# Altium schematic sheet CONNECTOR_B.SchDoc: =project_title
size Tabloid; CompanyName: Luxonis Holding; Organization: Luxonis Holding; Address1: 1925 Harmony Park Drive; Address2: Westminster, CO; Address3: 80234; Address4: United States; SheetNumber: 6; SheetTotal: 12
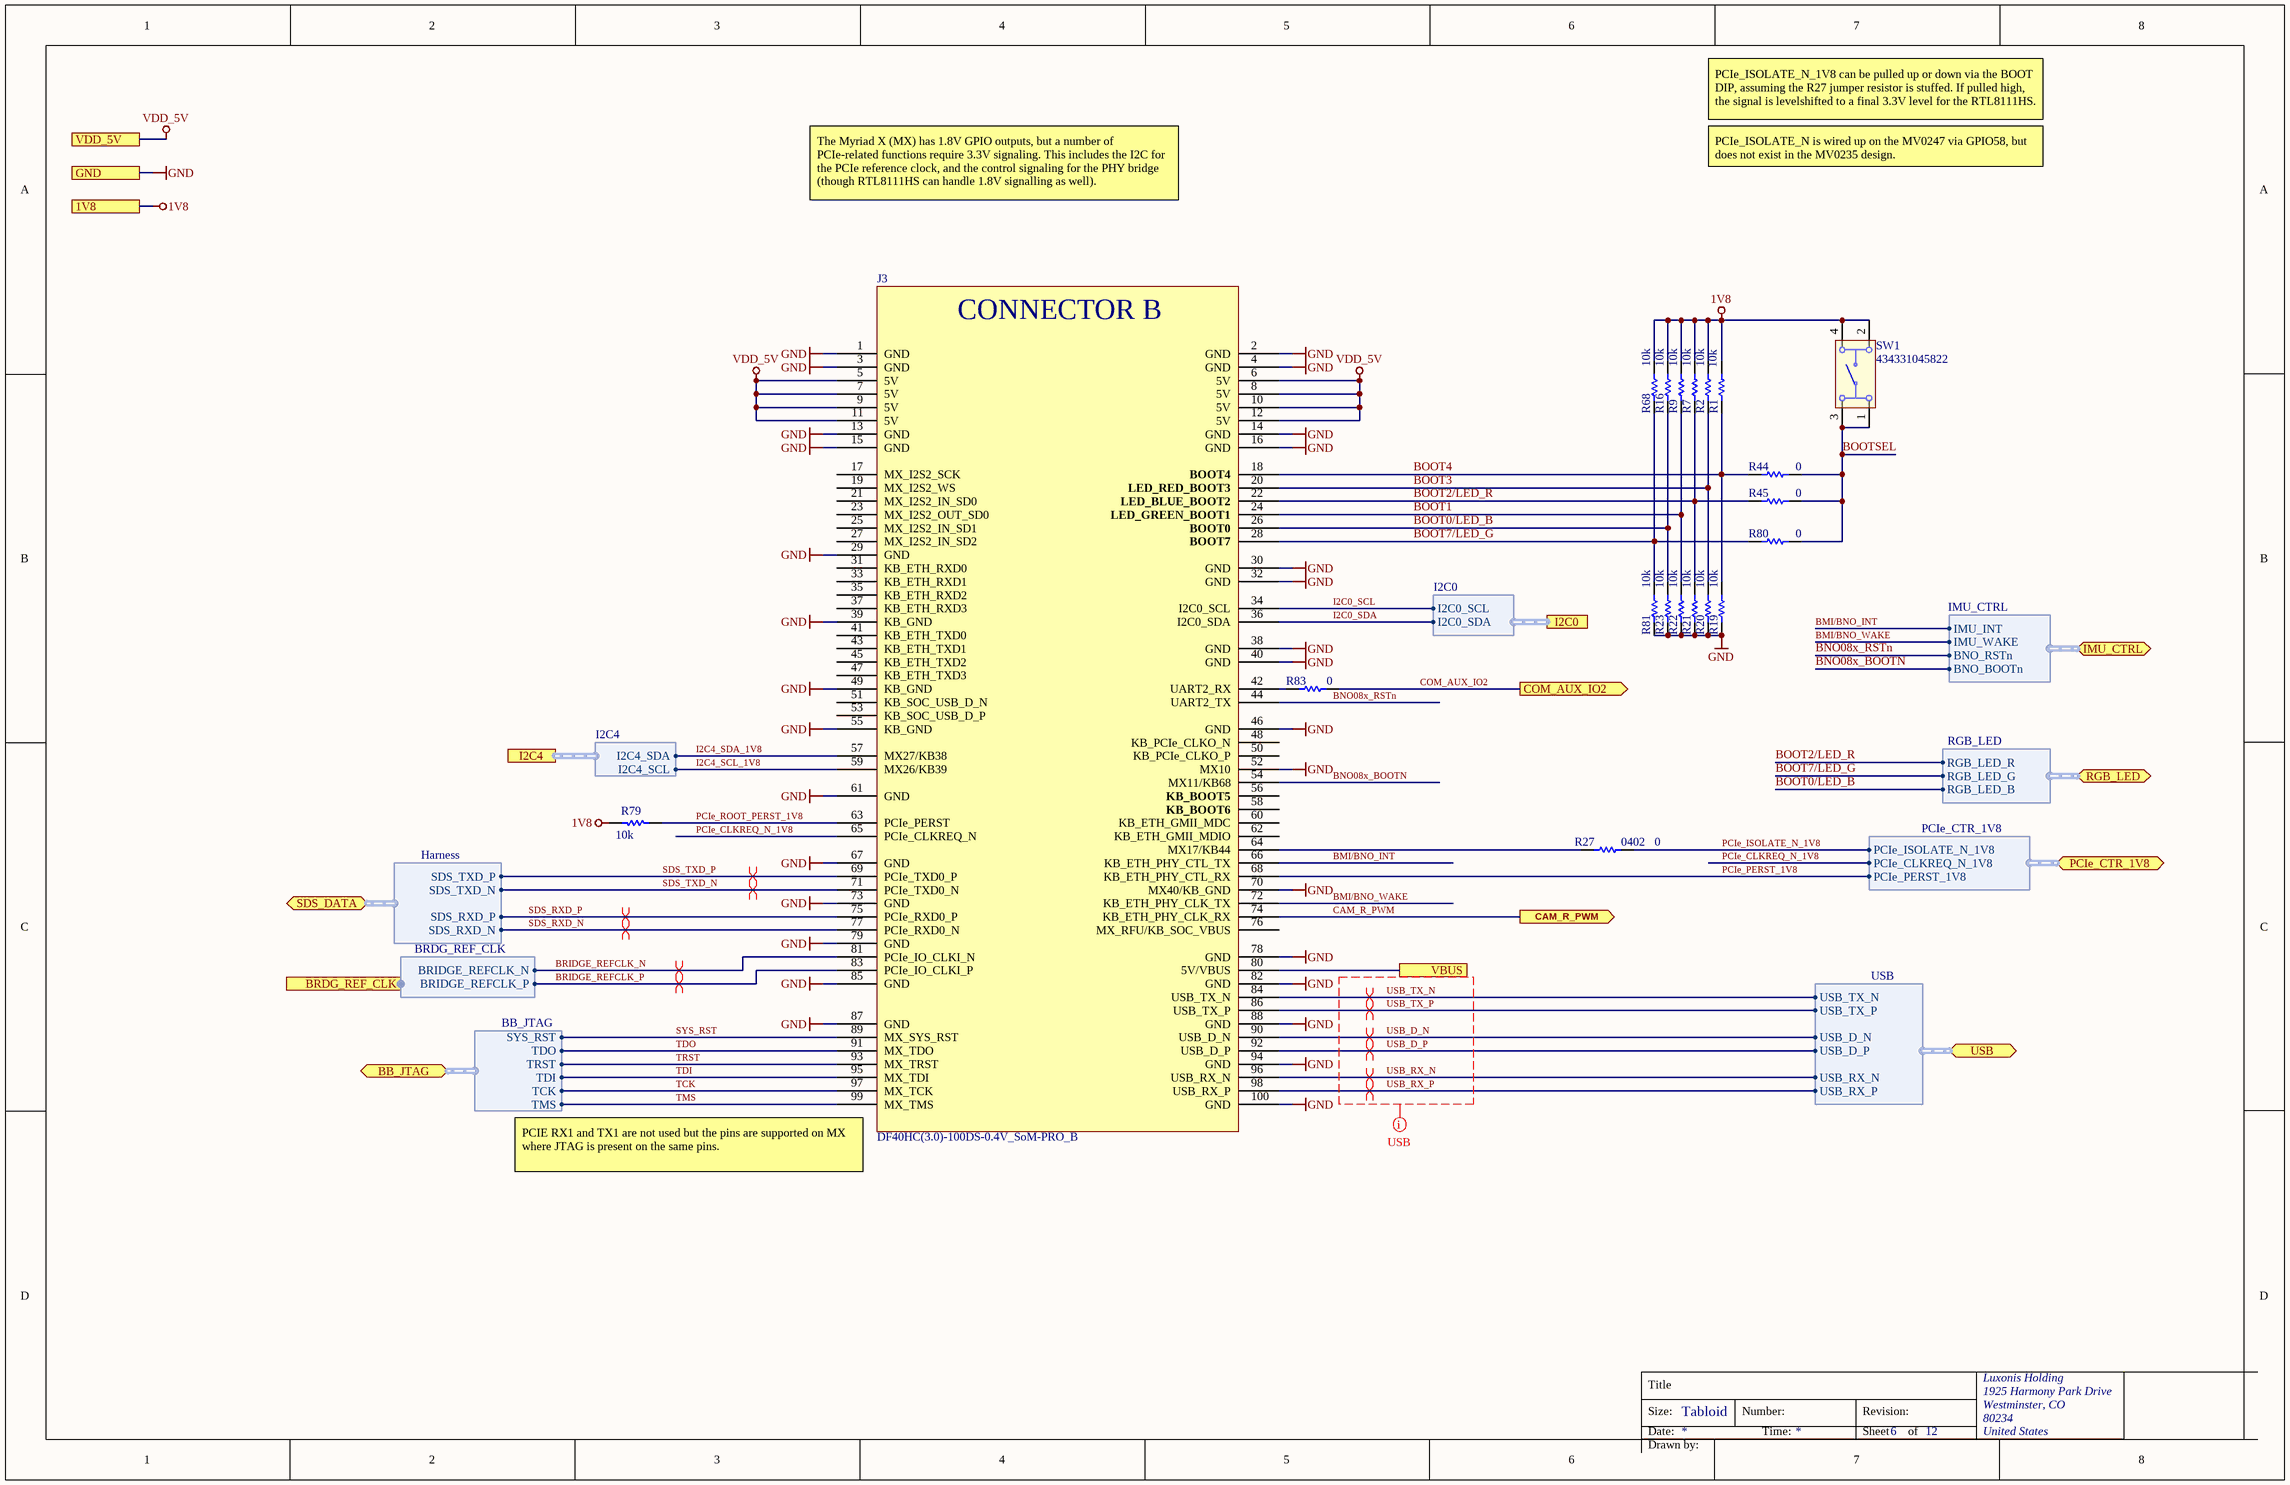
[diagram p0: CONNECTOR_B.SchDoc]

## Parts
J3  DF40HC(3.0)-100DS-0.4V_SoM-PRO_B  [CON_B_BW2099_SoM_DF40HC-3.0-100DS-0.4V_minpad]
R1  value 10k  [RESC0402(1005)_L]  (hidden comment: RC0402FR-1310KL)
R2  value 10k  [RESC0402(1005)_L]  (hidden comment: RC0402FR-1310KL)
R7  value 10k  [RESC0402(1005)_L]  (hidden comment: RC0402FR-1310KL)
R9  value 10k  [RESC0402(1005)_L]  (hidden comment: RC0402FR-1310KL)
R16  value 10k  [RESC0402(1005)_L]  (hidden comment: RC0402FR-1310KL)
R19  value 10k  [RESC0402(1005)_L]  (hidden comment: RC0402FR-1310KL)
R20  value 10k  [RESC0402(1005)_L]  (hidden comment: RC0402FR-1310KL)
R21  value 10k  [RESC0402(1005)_L]  (hidden comment: RC0402FR-1310KL)
R22  value 10k  [RESC0402(1005)_L]  (hidden comment: RC0402FR-1310KL)
R23  value 10k  [RESC0402(1005)_L]  (hidden comment: RC0402FR-1310KL)
R27  value 0  Case/Package: 0402  [RESC0402(1005)_L]  (hidden comment: CRCW04020000Z0ED)
R44  value 0  [RESC0402(1005)_L]  (hidden comment: CRCW04020000Z0ED)
R45  value 0  [RESC0402(1005)_L]  (hidden comment: CRCW04020000Z0ED)
R68  value 10k  [RESC0402(1005)_L]  (hidden comment: RC0402FR-1310KL)
R79  value 10k  [RESC0402(1005)_N]  (hidden comment: RC0402FR-1310KL)
R80  value 0  [RESC0402(1005)_L]  (hidden comment: CRCW04020000Z0ED)
R81  value 10k  [RESC0402(1005)_L]  (hidden comment: RC0402FR-1310KL)
R83  value 0  [RESC0402(1005)_L]  (hidden comment: CRCW04020000Z0ED)
SW1  434331045822  [434331045822]

## Ports
1V8, BB_JTAG (bidir, harness BB_JTAG), BRDG_REF_CLK (harness BRDG_REF_CLK), CAM_R_PWM (out), COM_AUX_IO2 (out), GND, I2C0 (harness I2C0), I2C4 (harness I2C4), IMU_CTRL (bidir, harness IMU_CTRL), PCIe_CTR_1V8 (bidir, harness PCIe_CTR_1V8), RGB_LED (bidir, harness RGB_LED), SDS_DATA (bidir, harness Harness), USB (bidir, harness USB), VBUS, VDD_5V

## Harnesses
USB: USB_RX_P, USB_RX_N, USB_D_P, USB_D_N, USB_TX_P, USB_TX_N
I2C0: I2C0_SDA, I2C0_SCL
BB_JTAG: SYS_RST, TDO, TRST, TDI, TCK, TMS
Harness: SDS_TXD_P, SDS_TXD_N, SDS_RXD_P, SDS_RXD_N
PCIe_CTR_1V8: PCIe_CLKREQ_N_1V8, PCIe_ISOLATE_N_1V8, PCIe_PERST_1V8
BRDG_REF_CLK: BRIDGE_REFCLK_P, BRIDGE_REFCLK_N
RGB_LED: RGB_LED_G, RGB_LED_B, RGB_LED_R
I2C4: I2C4_SDA, I2C4_SCL
IMU_CTRL: IMU_INT, IMU_WAKE, BNO_RSTn, BNO_BOOTn

## Nets
1V8: R1.2 R2.2 R7.2 R9.2 R16.2 R68.2 R79.1 SW1.2 SW1.4 ; port 1V8
GND: J3.1(GND) J3.2(GND) J3.3(GND) J3.4(GND) J3.13(GND) J3.14(GND) J3.15(GND) J3.16(GND) J3.29(GND) J3.30(GND) J3.32(GND) J3.38(GND) J3.39(KB_GND) J3.40(GND) J3.46(GND) J3.49(KB_GND) J3.52(MX10) J3.55(KB_GND) J3.61(GND) J3.67(GND) J3.70(MX40/KB_GND) J3.73(GND) J3.78(GND) J3.79(GND) J3.82(GND) J3.85(GND) J3.87(GND) J3.88(GND) J3.94(GND) J3.100(GND) R19.1 R20.1 R21.1 R22.1 R23.1 R81.1 ; port GND
VDD_5V: J3.5(5V) J3.6(5V) J3.7(5V) J3.8(5V) J3.9(5V) J3.10(5V) J3.11(5V) J3.12(5V) ; port VDD_5V
BMI/BNO_INT: J3.66(KB_ETH_PHY_CTL_TX) ; port IMU_CTRL.IMU_INT
BMI/BNO_WAKE: J3.72(KB_ETH_PHY_CLK_TX) ; port IMU_CTRL.IMU_WAKE
BNO08x_BOOTN: J3.54(MX11/KB68) ; port IMU_CTRL.BNO_BOOTn
BNO08x_RSTn: J3.44(UART2_TX) ; port IMU_CTRL.BNO_RSTn
BOOT0/LED_B: J3.26(BOOT0) R16.1 R23.2 ; port RGB_LED.RGB_LED_B
BOOT1: J3.24(LED_GREEN_BOOT1) R9.1 R22.2
BOOT2/LED_R: J3.22(LED_BLUE_BOOT2) R7.1 R21.2 R45.2 ; port RGB_LED.RGB_LED_R
BOOT3: J3.20(LED_RED_BOOT3) R2.1 R20.2
BOOT4: J3.18(BOOT4) R1.1 R19.2 R44.2
BOOT7/LED_G: J3.28(BOOT7) R68.1 R80.2 R81.2 ; port RGB_LED.RGB_LED_G
BOOTSEL: R44.1 R45.1 R80.1 SW1.1 SW1.3
BRIDGE_REFCLK_N: J3.81(PCIe_IO_CLKI_N) ; port BRDG_REF_CLK.BRIDGE_REFCLK_N
BRIDGE_REFCLK_P: J3.83(PCIe_IO_CLKI_P) ; port BRDG_REF_CLK.BRIDGE_REFCLK_P
CAM_R_PWM: J3.74(KB_ETH_PHY_CLK_RX) ; port CAM_R_PWM
COM_AUX_IO2: R83.1 ; port COM_AUX_IO2
I2C0_SCL: J3.34(I2C0_SCL) ; port I2C0.I2C0_SCL
I2C0_SDA: J3.36(I2C0_SDA) ; port I2C0.I2C0_SDA
I2C4_SCL_1V8: J3.59(MX26/KB39) ; port I2C4.I2C4_SCL
I2C4_SDA_1V8: J3.57(MX27/KB38) ; port I2C4.I2C4_SDA
PCIe_CLKREQ_N_1V8: J3.65(PCIe_CLKREQ_N) ; port PCIe_CTR_1V8.PCIe_CLKREQ_N_1V8
PCIe_ISOLATE_N_1V8: R27.2 ; port PCIe_CTR_1V8.PCIe_ISOLATE_N_1V8
PCIe_PERST_1V8: J3.68(KB_ETH_PHY_CTL_RX) ; port PCIe_CTR_1V8.PCIe_PERST_1V8
PCIe_ROOT_PERST_1V8: J3.63(PCIe_PERST) R79.2
SDS_RXD_N: J3.77(PCIe_RXD0_N) ; port SDS_DATA.SDS_RXD_N
SDS_RXD_P: J3.75(PCIe_RXD0_P) ; port SDS_DATA.SDS_RXD_P
SDS_TXD_N: J3.71(PCIe_TXD0_N) ; port SDS_DATA.SDS_TXD_N
SDS_TXD_P: J3.69(PCIe_TXD0_P) ; port SDS_DATA.SDS_TXD_P
SYS_RST: J3.89(MX_SYS_RST) ; port BB_JTAG.SYS_RST
TCK: J3.97(MX_TCK) ; port BB_JTAG.TCK
TDI: J3.95(MX_TDI) ; port BB_JTAG.TDI
TDO: J3.91(MX_TDO) ; port BB_JTAG.TDO
TMS: J3.99(MX_TMS) ; port BB_JTAG.TMS
TRST: J3.93(MX_TRST) ; port BB_JTAG.TRST
USB_D_N: J3.90(USB_D_N) ; port USB.USB_D_N
USB_D_P: J3.92(USB_D_P) ; port USB.USB_D_P
USB_RX_N: J3.96(USB_RX_N) ; port USB.USB_RX_N
USB_RX_P: J3.98(USB_RX_P) ; port USB.USB_RX_P
USB_TX_N: J3.84(USB_TX_N) ; port USB.USB_TX_N
USB_TX_P: J3.86(USB_TX_P) ; port USB.USB_TX_P
VBUS: J3.80(5V/VBUS) ; port VBUS
NetJ3_42: J3.42(UART2_RX) R83.2
NetJ3_64: J3.64(MX17/KB44) R27.1

Not connected (* = marked no-connect by the designer): J3 17(MX_I2S2_SCK) 19(MX_I2S2_WS) 21(MX_I2S2_IN_SD0) 23(MX_I2S2_OUT_SD0) 25(MX_I2S2_IN_SD1) 27(MX_I2S2_IN_SD2) 31(KB_ETH_RXD0) 33(KB_ETH_RXD1) 35(KB_ETH_RXD2) 37(KB_ETH_RXD3) 41(KB_ETH_TXD0) 43(KB_ETH_TXD1) 45(KB_ETH_TXD2) 47(KB_ETH_TXD3) 48(KB_PCIe_CLKO_N) 50(KB_PCIe_CLKO_P) 51(KB_SOC_USB_D_N) 53(KB_SOC_USB_D_P) 56(KB_BOOT5) 58(KB_BOOT6) 60(KB_ETH_GMII_MDC) 62(KB_ETH_GMII_MDIO) 76(MX_RFU/KB_SOC_VBUS)

## Layout directives
net class USB: USB_D_N, USB_D_P, USB_RX_N, USB_RX_P, USB_TX_N, USB_TX_P
differential pair; differential pair class 100ohm: BRIDGE_REFCLK_N, BRIDGE_REFCLK_P, SDS_RXD_N, SDS_RXD_P, SDS_TXD_N, SDS_TXD_P
differential pair; differential pair class USB3: USB_D_N, USB_D_P, USB_RX_N, USB_RX_P, USB_TX_N, USB_TX_P

## Notes on the sheet
- PCIe_ISOLATE_N_1V8 can be pulled up or down via the BOOT DIP, assuming the R27 jumper resistor is stuffed. If pulled high, the signal is levelshifted to a final 3.3V level for the RTL8111HS.
- PCIe_ISOLATE_N is wired up on the MV0247 via GPIO58, but does not exist in the MV0235 design.
- The Myriad X (MX) has 1.8V GPIO outputs, but a number of PCIe-related functions require 3.3V signaling. This includes the I2C for the PCIe reference clock, and the control signaling for the PHY bridge (though RTL8111HS can handle 1.8V signalling as well).
- (near J3) PCIE RX1 and TX1 are not used but the pins are supported on MX where JTAG is present on the same pins.
- Title
- Size:
- Date:
- Tabloid
- Number:
- Time:
- Revision:
- Sheet
- of
- Drawn by:
- (in symbol CMP-002-00155-6) CONNECTOR B

## Library data of the parts
J3 = CMP-002-00155-6: OAK-SoM-Pro_S2/S3 base board conn. B; Manufacturer Part Number 1: DF40HC(3.0)-100DS-0.4V(58); Manufacturer 1: Hirose; Number of Positions: 100; Connector Type: Receptacle; System: Connector; Gender: Female; Pitch: 0.016inch; ComponentLink4Description: https://datasheet.ciiva.com/18562/ed-df40-20140305-18562462.pdf?src-supplier=Digi-Key; ComponentLink2Description: https://datasheet.ciiva.com/18562/ed-df40-20140305-18562189.pdf?src-supplier=Digi-Key; ComponentLink4URL: https://datasheet.ciiva.com/18562/ed-df40-20140305-18562462.pdf?src-supplier=Digi-Key; ComponentLink2URL: https://datasheet.ciiva.com/18562/ed-df40-20140305-18562189.pdf?src-supplier=Digi-Key; Pins: 100; Lead Free: Lead Free; Package Quantity: 1000; Stock 2: 2078; Mount: Surface Mount; ComponentLink1URL: https://datasheet.ciiva.com/46636/ed-df40-20140305-46636517.pdf?src-supplier=Digi-Key; ComponentLink3URL: https://datasheet.ciiva.com/13559/ed-df40-20140305-13559540.pdf?src-supplier=Mouser; ComponentLink3Description: https://datasheet.ciiva.com/13559/ed-df40-20140305-13559540.pdf?src-supplier=Mouser; Pricing 2: 1=2.50000, 10=2.40000, 25=2.10000, 50=2.10000, 100=2.00000, 250=1.76000, 500=1.71000, 1000=1.45000, 2000=1.36000, 5000=1.31000, 10000=1.31000 (USD); Design Item ID: DF40HC(3.0)-100DS-0.4V_SoM-PRO_B; ComponentLink1Description: https://datasheet.ciiva.com/46636/ed-df40-20140305-46636517.pdf?src-supplier=Digi-Key; Mounting Technology: SMT; RoHS: Yes; Stock 1: 2172; Pricing 1: 1=2.54000, 10=2.26000, 25=2.07000, 50=2.07000, 100=1.98000, 250=1.79000, 500=1.65000, 1000=1.41000, 3000=1.32000, 6000=1.23000, 10000=1.23000 (USD); Number of Rows: 2; Contact Plating: Gold; Packaging: Tape and Reel; Source: LuxonisMaster.SchLib
R1 R2 R7 R9 R16 R19-R23 R68 R81 = CMP-115-000004-7: RES SMD 10K OHM 1% 1/16W 0402; Manufacturer 1: Yageo; Temperature Coefficient: 100ppm/°C; Power Rating: 62.5mW; Voltage Rating: 50V; Manufacturer Part Number 1: RC0402FR-1310KL; Case/Package: 0402; Min Operating Temperature: -55°C; Max Operating Temperature: 155°C; Tolerance: 1%; Design Item ID: RC0402FR-1310KL
R27 = CMP-013-000022-11: RES SMD 0 OHM 5% 1/16W 0402; Manufacturer 1: Vishay; Power Rating: 63mW; Voltage Rating: 50V; Manufacturer Part Number 1: CRCW04020000Z0ED; Min Operating Temperature: -55°C; Max Operating Temperature: 155°C; Tolerance: 5%; Design Item ID: CRCW04020000Z0ED
R44 R45 R80 R83 = CMP-013-000022-10: RES SMD 0 OHM 5% 1/16W 0402; Manufacturer 1: Vishay; Power Rating: 63mW; Voltage Rating: 50V; Manufacturer Part Number 1: CRCW04020000Z0ED; Case/Package: 0402; Min Operating Temperature: -55°C; Max Operating Temperature: 155°C; Tolerance: 5%; Design Item ID: CRCW04020000Z0ED
R79 = CMP-115-000004-8: RES SMD 10K OHM 1% 1/16W 0402; Manufacturer 1: Yageo; Temperature Coefficient: 100ppm/°C; Power Rating: 62.5mW; Voltage Rating: 50V; Manufacturer Part Number 1: RC0402FR-1310KL; Case/Package: 0402; Min Operating Temperature: -55°C; Max Operating Temperature: 155°C; Tolerance: 1%; Design Item ID: RC0402FR-1310KL
SW1 = CMP-011-00016-3: Keypad Switch, 1 Switches, SPST, Momentary-tactile, 0.05A, 12VDC, 2.65N, Solder Terminal, Surface Mount-right Angle; Manufacturer 1: Wurth Electronics; Voltage Rating: 12V; Max Current Rating: 50mA; Throw Configuration: SPST-NO; Supplier Part Number 1: 732-7055-2-ND; Manufacturer part number 1: 434331045822; Pins: 4; Supplier 1: Digi-Key; Current Rating: 50mA; Mounting Technology: SMD; Case/Package: 434331045822